# EAGLE design Wireless_Motor_Driver_Shield (EAGLE 7.6.0)
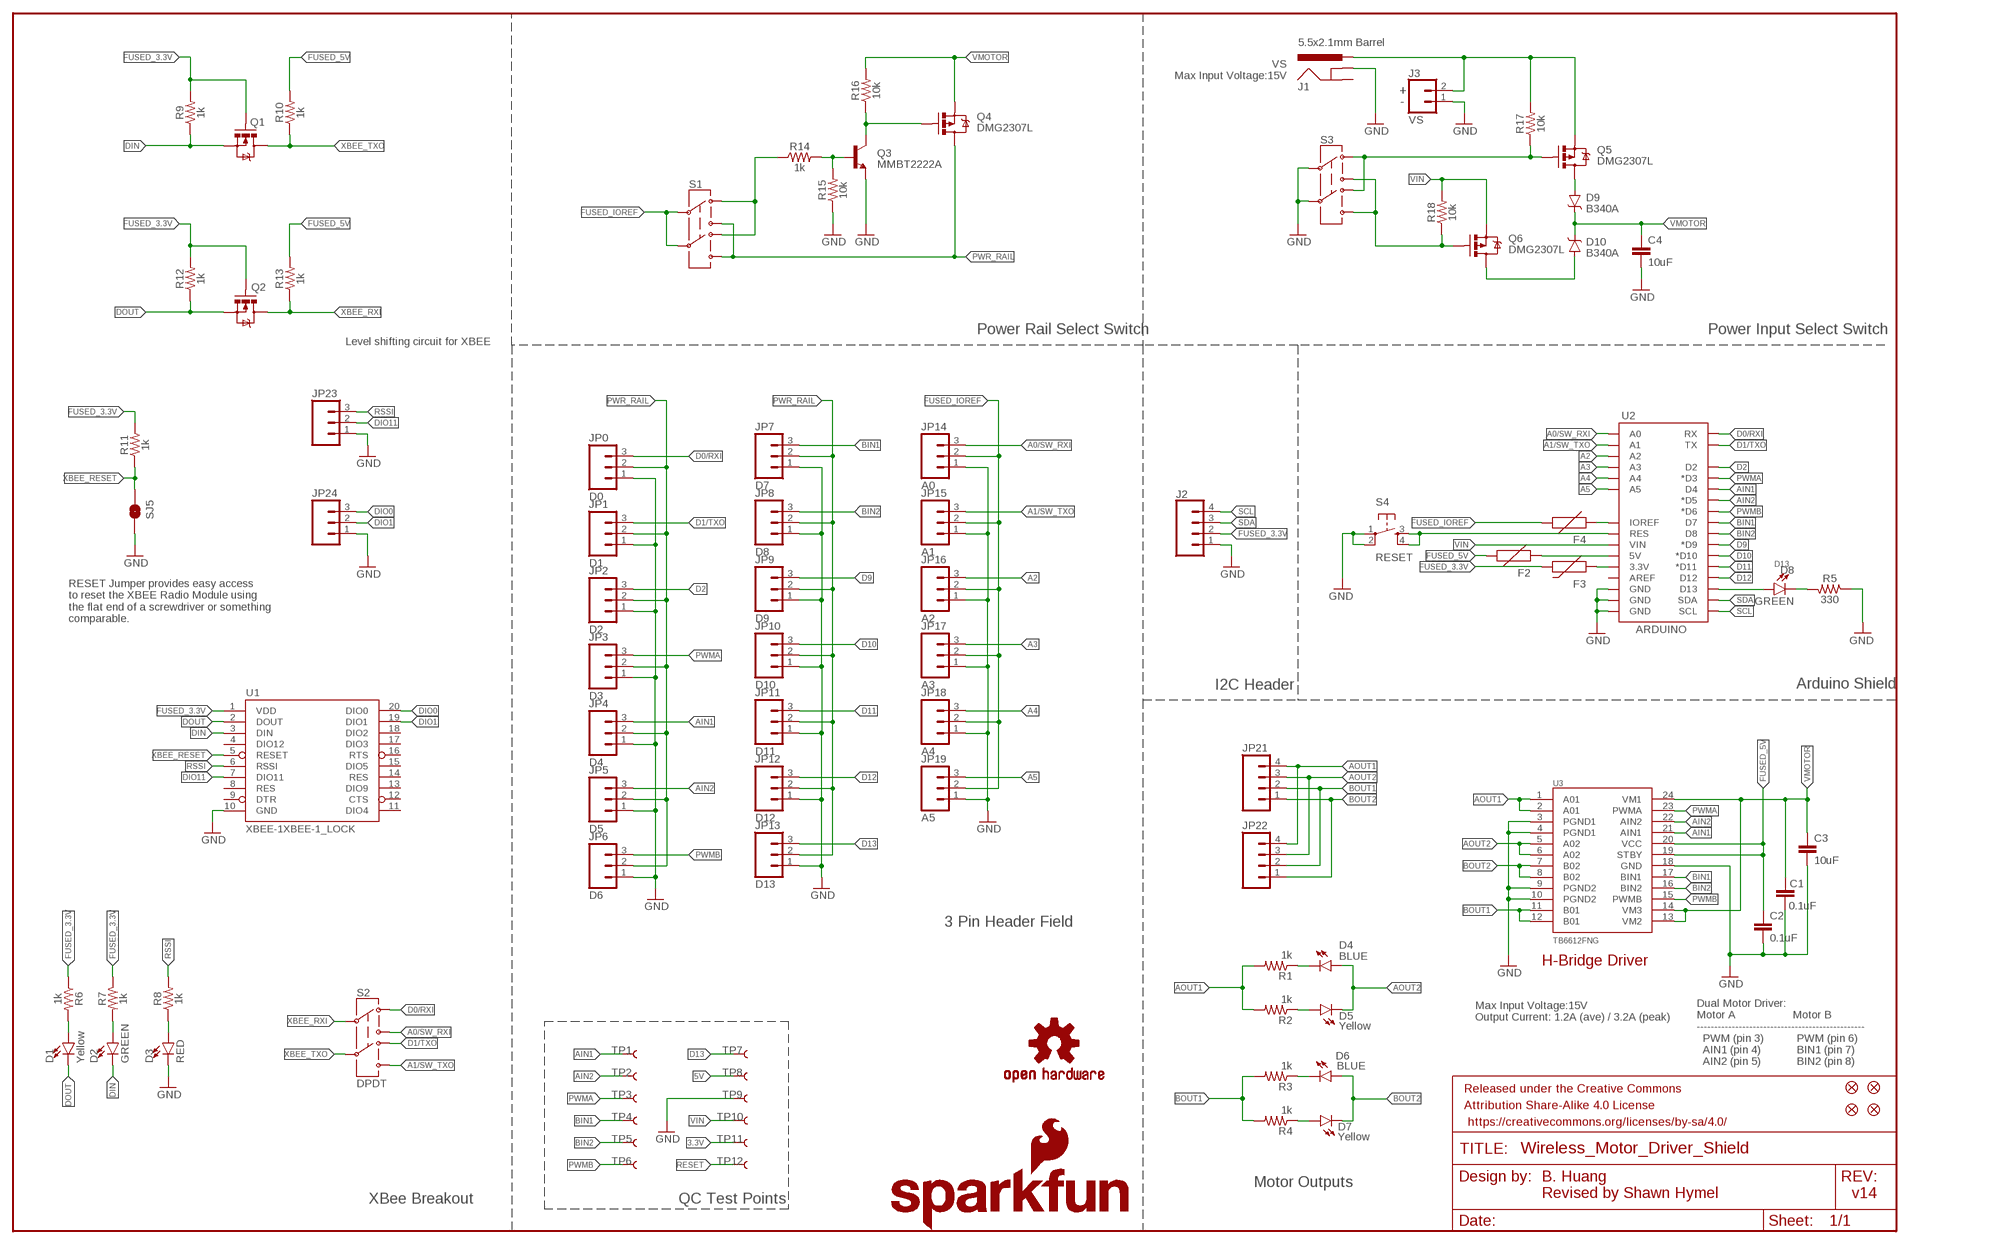
[diagram p0: schematic, sheet 1]

## Parts
C1  0.1uF  0.1UF-0603-25V-5%  [0603]
C2  0.1uF  0.1UF-0603-25V-5%  [0603]
C3  10uF  10UF-1210-50V-20%  [1210]
C4  10uF  10UF-1210-50V-20%  [1210]
D1  Yellow  LED-YELLOW0603  [LED-0603]
D2  GREEN  LED-GREEN0603  [LED-0603]
D3  RED  LED-RED0603  [LED-0603]
D4  BLUE  LED-BLUE0603  [LED-0603]
D5  Yellow  LED-YELLOW0603  [LED-0603]
D6  BLUE  LED-BLUE0603  [LED-0603]
D7  Yellow  LED-YELLOW0603  [LED-0603]
D8  GREEN  LED-GREEN0603  [LED-0603]
D9  B340A  DIODE-SCHOTTKY-B340A  [SMA-DIODE]
D10  B340A  DIODE-SCHOTTKY-B340A  [SMA-DIODE]
F2  PTCSMD  [PTC-1206]
F3  PTCSMD  [PTC-1206]
F4  PTCSMD  [PTC-1206]
FID1  FIDUCIAL1X2  [FIDUCIAL-1X2]
FID2  FIDUCIAL1X2  [FIDUCIAL-1X2]
FID3  FIDUCIAL1X2  [FIDUCIAL-1X2]
FID4  FIDUCIAL1X2  [FIDUCIAL-1X2]
FRAME1  FRAME-LEDGER  [CREATIVE_COMMONS]
J1  5.5x2.1mm Barrel  POWER_JACKSMD  [POWER_JACK_SMD]
J2  CONN_04SMD_RA_FEMALE  [1X04_SMD_RA_FEMALE]
J3  CONN_021X02_NO_SILK  [1X02_NO_SILK]
JP0  D0  M03LOCK  [1X03_LOCK]
JP1  D1  M03LOCK  [1X03_LOCK]
JP2  D2  M03LOCK  [1X03_LOCK]
JP3  D3  M03LOCK  [1X03_LOCK]
JP4  D4  M03LOCK  [1X03_LOCK]
JP5  D5  M03LOCK  [1X03_LOCK]
JP6  D6  M03LOCK  [1X03_LOCK]
JP7  D7  M03LOCK  [1X03_LOCK]
JP8  D8  M03LOCK  [1X03_LOCK]
JP9  D9  M03LOCK  [1X03_LOCK]
JP10  D10  M03LOCK  [1X03_LOCK]
JP11  D11  M03LOCK  [1X03_LOCK]
JP12  D12  M03LOCK  [1X03_LOCK]
JP13  D13  M03LOCK  [1X03_LOCK]
JP14  A0  M03LOCK  [1X03_LOCK]
JP15  A1  M03LOCK  [1X03_LOCK]
JP16  A2  M03LOCK  [1X03_LOCK]
JP17  A3  M03LOCK  [1X03_LOCK]
JP18  A4  M03LOCK  [1X03_LOCK]
JP19  A5  M03LOCK  [1X03_LOCK]
JP21  M04PTH  [1X04@1]
JP22  M04LOCK  [1X04_LOCK@1]
JP23  M031X03_NO_SILK  [1X03_NO_SILK]
JP24  M031X03_NO_SILK  [1X03_NO_SILK]
LOGO1  OSHW-LOGOM  [OSHW-LOGO-M]
LOGO2  SFE_LOGO_NAME_FLAME.1_INCH  [SFE_LOGO_NAME_FLAME_.1]
LOGO3  SFE_LOGO_FLAME.2_INCH  [SFE_LOGO_FLAME_.2]
LOGO4  SFE_LOGO_NAME_FLAME.1_INCH  [SFE_LOGO_NAME_FLAME_.1]
Q1  MOSFET-NCHANNELBSS138  [SOT23-3]
Q2  MOSFET-NCHANNELBSS138  [SOT23-3]
Q3  MMBT2222A  TRANSISTOR_NPNMMBT2222A  [SOT23-3]
Q4  DMG2307L  MOSFET-PCHANNELDMG2307L  [SOT23-3]
Q5  DMG2307L  MOSFET-PCHANNELDMG2307L  [SOT23-3]
Q6  DMG2307L  MOSFET-PCHANNELDMG2307L  [SOT23-3]
R1  1k  1KOHM-0603-1/10W-1%  [0603]
R2  1k  1KOHM-0603-1/10W-1%  [0603]
R3  1k  1KOHM-0603-1/10W-1%  [0603]
R4  1k  1KOHM-0603-1/10W-1%  [0603]
R5  330  330OHM-0603-1/10W-1%  [0603]
R6  1k  1KOHM-0603-1/10W-1%  [0603]
R7  1k  1KOHM-0603-1/10W-1%  [0603]
R8  1k  1KOHM-0603-1/10W-1%  [0603]
R9  1k  1KOHM-0603-1/10W-1%  [0603]
R10  1k  1KOHM-0603-1/10W-1%  [0603]
R11  1k  1KOHM-0603-1/10W-1%  [0603]
R12  1k  1KOHM-0603-1/10W-1%  [0603]
R13  1k  1KOHM-0603-1/10W-1%  [0603]
R14  1k  1KOHM-0603-1/10W-1%  [0603]
R15  10k  10KOHM-0603-1/10W-1%  [0603]
R16  10k  10KOHM-0603-1/10W-1%  [0603]
R17  10k  10KOHM-0603-1/10W-1%  [0603]
R18  10k  10KOHM-0603-1/10W-1%  [0603]
S1  SWITCH-DPDTAYZ0202  [AYZ0202]
S2  DPDT  SWITCH-DPDTAYZ0202  [AYZ0202]
S3  SWITCH-DPDTAYZ0202  [AYZ0202]
S4  RESET  TAC_SWITCHSMD  [TACTILE-SWITCH-SMD]
SJ5  SOLDERJUMPERNO  [SJ_2S-NO]
TP1  TEST-POINT3X5  [PAD.03X.05]
TP2  TEST-POINT3X5  [PAD.03X.05]
TP3  TEST-POINT3X5  [PAD.03X.05]
TP4  TEST-POINT3X5  [PAD.03X.05]
TP5  TEST-POINT3X5  [PAD.03X.05]
TP6  TEST-POINT3X5  [PAD.03X.05]
TP7  TEST-POINT3X5  [PAD.03X.05]
TP8  TEST-POINT3X5  [PAD.03X.05]
TP9  TEST-POINT3X5  [PAD.03X.05]
TP10  TEST-POINT3X5  [PAD.03X.05]
TP11  TEST-POINT3X5  [PAD.03X.05]
TP12  TEST-POINT3X5  [PAD.03X.05]
U1  XBEE-1XBEE-1_LOCK  [XBEE-1_LOCK]
U2  ARDUINO  ARDUINO_R3_SHIELDUNO_R3_SHIELD_NOLABELS_LOCK  [UNO_R3_SHIELD_NOLABELS_LOCK]
U3  TB6612FNG  [SSOP24]

## Nets
3.3V: F3.1 TP11.P$1 U2.3.3V
5V: F2.1 TP8.P$1 U2.5V
A0/SW_RXI: JP14.3 S2.3 U2.A0
A1/SW_TXO: JP15.3 S2.6 U2.A1
A2: JP16.3 U2.A2
A3: JP17.3 U2.A3
A4: JP18.3 U2.A4
A5: JP19.3 U2.A5
AIN1: JP4.3 TP1.P$1 U2.D4 U3.21(AIN1)
AIN2: JP5.3 TP2.P$1 U2.D5(*D5) U3.22(AIN2)
AOUT1: JP21.4 JP22.4 R1.2 R2.2 U3.1(A01) U3.2(A01)
AOUT2: D4.A D5.C JP21.3 JP22.3 U3.5(A02) U3.6(A02)
BIN1: JP7.3 TP4.P$1 U2.D7 U3.17(BIN1)
BIN2: JP8.3 TP5.P$1 U2.D8 U3.16(BIN2)
BOUT1: JP21.2 JP22.2 R3.2 R4.2 U3.11(B01) U3.12(B01)
BOUT2: D6.A D7.C JP21.1 JP22.1 U3.7(B02) U3.8(B02)
D0/RXI: JP0.3 S2.1 U2.RX
D1/TXO: JP1.3 S2.4 U2.TX
D2: JP2.3 U2.D2
D9: JP9.3 U2.D9(*D9)
D10: JP10.3 U2.D10(*D10)
D11: JP11.3 U2.D11(*D11)
D12: JP12.3 U2.D12
D13: D8.A JP13.3 TP7.P$1 U2.D13
DIN: D2.C Q1.2(S) R9.1 U1.3(DIN)
DIO0: JP24.3 U1.20(DIO0)
DIO1: JP24.2 U1.19(DIO1)
DIO11: JP23.2 U1.7(DIO11)
DOUT: D1.C Q2.2(S) R12.1 U1.2(DOUT)
FUSED_3.3V: F3.2 J2.2 Q1.1(G) Q2.1(G) R6.1 R7.1 R9.2 R11.2 R12.2 U1.1(VDD)
FUSED_5V: C2.1 F2.2 R10.2 R13.2 U3.19(STBY) U3.20(VCC)
FUSED_IOREF: F4.2 JP14.2 JP15.2 JP16.2 JP17.2 JP18.2 JP19.2 S1.2 S1.5
GND: C1.2 C2.2 C3.2 C4.2 D3.C J1.GND(GNDBREAK) J2.1 J3.1 JP0.1 JP1.1 JP2.1 JP3.1 JP4.1 JP5.1 JP6.1 JP7.1 JP8.1 JP9.1 JP10.1 JP11.1 JP12.1 JP13.1 JP14.1 JP15.1 JP16.1 JP17.1 JP18.1 JP19.1 JP23.1 JP24.1 Q3.2(E) R5.1 R15.1 S3.2 S3.5 S4.1 S4.2 SJ5.2 TP9.P$1 U1.10(GND) U2.GND@0(GND) U2.GND@1(GND) U2.GND@2(GND) U3.3(PGND1) U3.4(PGND1) U3.9(PGND2) U3.10(PGND2) U3.18(GND)
IOREF: F4.1 U2.IOREF
N$1: D8.C R5.2
N$2: Q3.1(B) R14.2 R15.2
N$3: D5.A R2.1
N$4: Q6.1(G) R18.1 S3.3 S3.6
N$5: D4.C R1.1
N$8: D7.A R4.1
N$9: D6.C R3.1
N$10: J1.VIN0(PWR) J3.2 Q5.2(S) R17.2
N$11: Q3.3(C) Q4.1(G) R16.1
N$12: Q5.1(G) R17.1 S3.1 S3.4
N$13: R14.1 S1.1 S1.4
N$15: D9.A Q5.3(D)
N$16: D10.A Q6.3(D)
N$22: D1.A R6.2
N$43: D2.A R7.2
N$44: D3.A R8.1
PWMA: JP3.3 TP3.P$1 U2.D3(*D3) U3.23(PWMA)
PWMB: JP6.3 TP6.P$1 U2.D6(*D6) U3.15(PWMB)
PWR_RAIL: JP0.2 JP1.2 JP2.2 JP3.2 JP4.2 JP5.2 JP6.2 JP7.2 JP8.2 JP9.2 JP10.2 JP11.2 JP12.2 JP13.2 Q4.3(D) S1.3 S1.6
RESET: S4.3 S4.4 TP12.P$1 U2.RES
RSSI: JP23.3 R8.2 U1.6(RSSI)
SCL: J2.4 U2.SCL
SDA: J2.3 U2.SDA
VIN: Q6.2(S) R18.2 TP10.P$1 U2.VIN
VMOTOR: C1.1 C3.1 C4.1 D9.C D10.C Q4.2(S) R16.2 U3.13(VM2) U3.14(VM3) U3.24(VM1)
XBEE_RESET: R11.1 SJ5.1 U1.5(RESET)
XBEE_RXI: Q2.3(D) R13.1 S2.2
XBEE_TXO: Q1.3(D) R10.1 S2.5
Unconnected: J1.P$4(GND) U1.4(DIO12) U1.8(RES) U1.9(DTR) U1.11(DIO4) U1.12(CTS) U1.13(DIO9) U1.14(RES) U1.15(DIO5) U1.16(RTS) U1.17(DIO3) U1.18(DIO2) U2.AREF

## Notes on the sheet
- VS
  Max Input Voltage:15V
- +
- -
- VS
- Power Rail Select Switch | Power Input Select Switch
- Level shifting circuit for XBEE
- RESET Jumper provides easy access 
  to reset the XBEE Radio Module using 
  the flat end of a screwdriver or something
  comparable.
- I2C Header | Arduino Shield
- 3 Pin Header Field
- H-Bridge Driver
- Max Input Voltage:15V
  Output Current: 1.2A (ave) / 3.2A (peak)
- Dual Motor Driver:
  Motor A                   Motor B
  ------------------------------------------------
    PWM (pin 3)           PWM (pin 6) 
    AIN1 (pin 4)            BIN1 (pin 7)
    AIN2 (pin 5)            BIN2 (pin 8)
- Motor Outputs
- B. Huang
  Revised by Shawn Hymel
- v14
- XBee Breakout | QC Test Points

## Library data of the parts
C1 C2 = SparkFun-Capacitors:0.1UF: 0.1µF ceramic capacitors A capacitor is a passive two-terminal electrical component used to store electrical energy temporarily in an electric field.; PROD_ID: CAP-08604
C3 C4 = SparkFun-Capacitors:10UF: 10.0µF ceramic capacitors A capacitor is a passive two-terminal electrical component used to store electrical energy temporarily in an electric field.; PROD_ID: CAP-09824
D1 D5 D7 = SparkFun-LED:LED-YELLOW: Yellow SMD LED Used in manufacturing several products at SparkFun. Packages: 0603 - SMD 0603 package[Product Link] <http://www.kingbrightusa.com/product.asp?catalog_name=LED&product_id=APT1608SYCK> 0603 -SMART - SMART SMD 0603 package (more efficient/more expensive) [Product Link] <http://www.osram-os.com/osram_os/en/products/product-catalog/led-light-emitting-diodes/smartled-0603/ly-l29k/index.jsp> LilyPad - SMD1206 package[Product Datasheet] <https://www.sparkfun.com/datasheets/DevTools/LilyPad/Q150YUS4.pdf> SparkFun Products: Blynk Board <https://www.sparkfun.com/products/13794> IOIO-OTG <https://www.sparkfun.com/products/13613> XBee Explorer Serial <https://www.sparkfun.com/products/13225>; PROD_ID: DIO-09003
D2 D8 = SparkFun-LED:LED-GREEN: Green SMD LED Used in manufacturing of various products at SparkFun Packages: 0603 - SMD 0603 package [Product Link] <http://www.futureelectronics.com/en/technologies/semiconductors/optoelectronics/leds/Pages/9894312-LTST-C190GKT.aspx?CrossPart=HSMG-C190&IM=0> LilyPad 1206 - SMD1206 LilyPad package [Product Link] <http://www.futureelectronics.com/en/Technologies/Product.aspx?ProductID=IN150NGHARVATEKCORPORATION2049943&IM=0> 1206 - SMD1206 package [Product Link] <http://www.futureelectronics.com/en/technologies/semiconductors/optoelectronics/leds/Pages/8315665-LTST-C150KGKT.aspx?IM=0> 1206 Bottom Mount -SMD 1206 Bottom Mount [Product Link] <http://www.digikey.com/product-detail/en/lite-on-inc/LTST-C230KGKT/160-1456-1-ND/386854> SparkFun Products: Pro Mini 328 -5V <https://www.sparkfun.com/products/821> RedBoard <https://www.sparkfun.com/products/12757> MP3 Trigger <https://www.sparkfun.com/products/13720> Makey Makey <https://www.sparkfun.com/products/11076>; PROD_ID: DIO-00821
D3 = SparkFun-LED:LED-RED: Red SMD LED Used in manufacturing of most products at SparkFun Packages: 0603 - SMD 0603 package [Product Link] <http://docs.avagotech.com/docs/AV02-0551EN> 0603 SMART - SMD 0603 SMART package ( more efficient and expensive)[Product Link] <http://www.osram-os.com/Graphics/XPic2/00077099_0.pdf> 1206 - SMD1206 package [Product Link] <https://www.sparkfun.com/datasheets/DevTools/LilyPad/Q150OVS4.pdff> SparkFun Products: Pro Mini 328 -5V <https://www.sparkfun.com/products/821> RedBoard <https://www.sparkfun.com/products/12757> IOIO-OTG <https://www.sparkfun.com/products/13613>; PROD_ID: DIO-00819
D4 D6 = SparkFun-LED:LED-BLUE: Blue SMD LED Used in manufacturing of various products at SparkFun Packages: 0603 - SMD 0603 package [Product Link] <http://www.digikey.com/product-detail/en/SMLE12BC7TT86/511-1589-2-ND/1641808> 1206 - SMD1206 package [Product Link] <http://www.digikey.com/product-detail/en/lite-on-inc/LTST-C150TBKT/160-1643-1-ND/573584> SparkFun Products: ESP8266 Thing-Dev Board <https://www.sparkfun.com/products/13711> RedBoard <https://www.sparkfun.com/products/12757>; PROD_ID: DIO-08575
D9 D10 = SparkFun-DiscreteSemi:DIODE-SCHOTTKY: Schottky diodes in SFE's production catalog BAT20J 1A 23V 0.62Vf RB751 120mA 40V 0.37Vf PMEG4005EJ 0.5A 40V 0.42Vf MBRA140 1A 40V 0.5Vf B340A 3A 40V SMA; PROD_ID: DIO-09886
F2-F4 = SparkFun-PowerIC:PTC: Resettable Fuse PTC Resettable Fuse. Spark Fun Electronics SKU : COM-08357; PROD_ID: RES-11150
FID1-FID4 = SparkFun-Aesthetics:FIDUCIAL: Fiducial Alignment Points Various fiducial points for machine vision alignment.
FRAME1 = SparkFun-Aesthetics:FRAME-LEDGER: Schematic Frame Standard 11x14 US Ledger frame
J1 = SparkFun-Connectors:POWER_JACK: Power Jack Connector This is the standard 5.5mm barrel jack for power. The PTH is the most common, proven, reliable, footprint. The Slot footprint only works if the mill layer is transmitted to the PCB fab house so be warned. Here are the connectors we sell at SparkFun: DC Barrel Power Jack/Connector <https://www.sparkfun.com/products/119> (PRT-00119) DC Barrel Power Jack/Connector (SMD) <https://www.sparkfun.com/products/12748> (PRT-12748) DC Barrel Jack Adapter - Breadboard Compatible <https://www.sparkfun.com/products/10811> (PRT-10811) It is used on this SparkFun product (and many, many others): SparkFun RedBoard - Programmed with Arduino <https://www.sparkfun.com/products/12757> (DEV-12757) Also, if you need a mating power supply or connector, please check these out: Wall Adapter Power Supply - 9VDC 650mA <https://www.sparkfun.com/products/298> (TOL-00298) DC Barrel Jack Adapter - Male <https://www.sparkfun.com/products/10287> (PRT-10287); PROD_ID: CONN-08106; SF_ID: PRT-12748
J2 = SparkFun-Connectors:CONN_04: Multi connection point. Often used as Generic Header-pin footprint for 0.1 inch spaced/style header connections On any of the 0.1 inch spaced packages, you can populate with these: Break Away Headers - Straight <https://www.sparkfun.com/products/116> (PRT-00116) Break Away Male Headers - Right Angle <https://www.sparkfun.com/products/553> (PRT-00553) Female Headers <https://www.sparkfun.com/products/115> (PRT-00115) Break Away Headers - Machine Pin <https://www.sparkfun.com/products/117> (PRT-00117) Break Away Female Headers - Swiss Machine Pin <https://www.sparkfun.com/products/743> (PRT-00743) For SCREWTERMINALS and SPRING TERMINALS visit here: Screw Terimnals on SparkFun.com <https://www.sparkfun.com/search/results?term=Screw+Terminals> (5mm/3.5mm/2.54mm spacing) This device is also useful as a general connection point to wire up your design to another part of your project. Our various solder wires solder well into these plated through hole pads. Hook-Up Wire - Assortment (Stranded, 22 AWG) <https://www.sparkfun.com/products/11375> (PRT-11375) Hook-Up Wire - Assortment (Solid Core, 22 AWG) <https://www.sparkfun.com/products/11367> (PRT-11367) View the entire wire category on our website here <https://www.sparkfun.com/categories/141> Special notes: Molex polarized connector foot print use with SKU : PRT-08231 with associated crimp pins and housings. 1MM SMD Version SKU: PRT-10208; PROD_ID: CONN-12382
J3 = SparkFun-Connectors:CONN_02: Multi connection point. Often used as Generic Header-pin footprint for 0.1 inch spaced/style header connections On any of the 0.1 inch spaced packages, you can populate with these: Break Away Headers - Straight <https://www.sparkfun.com/products/116> (PRT-00116) Break Away Male Headers - Right Angle <https://www.sparkfun.com/products/553> (PRT-00553) Female Headers <https://www.sparkfun.com/products/115> (PRT-00115) Break Away Headers - Machine Pin <https://www.sparkfun.com/products/117> (PRT-00117) Break Away Female Headers - Swiss Machine Pin <https://www.sparkfun.com/products/743> (PRT-00743) For SCREWTERMINALS and SPRING TERMINALS visit here: Screw Terimnals on SparkFun.com <https://www.sparkfun.com/search/results?term=Screw+Terminals> (5mm/3.5mm/2.54mm spacing) This device is also useful as a general connection point to wire up your design to another part of your project. Our various solder wires solder well into these plated through hole pads. Hook-Up Wire - Assortment (Stranded, 22 AWG) <https://www.sparkfun.com/products/11375> (PRT-11375) Hook-Up Wire - Assortment (Solid Core, 22 AWG) <https://www.sparkfun.com/products/11367> (PRT-11367) View the entire wire category on our website here <https://www.sparkfun.com/categories/141> Special notes: Molex polarized connector foot print use with: PRT-08233 with associated crimp pins and housings. 2.54_SCREWTERM for use with PRT-10571. 3.5mm Screw Terminal footprints for PRT-08084 5mm Screw Terminal footprints for use with PRT-08432
JP0 JP1-JP19 JP23 JP24 = SparkFun-Connectors:M03: Header 3 Standard 3-pin 0.1" header. Use with straight break away headers (SKU : PRT-00116), right angle break away headers (PRT-00553), swiss pins (PRT-00743), machine pins (PRT-00117), and female headers (PRT-00115). Molex polarized connector foot print use with SKU : PRT-08232 with associated crimp pins and housings.
JP21 JP22 = SparkFun-Connectors:M04: Header 4 Standard 4-pin 0.1" header. Use with straight break away headers (SKU : PRT-00116), right angle break away headers (PRT-00553), swiss pins (PRT-00743), machine pins (PRT-00117), and female headers (PRT-00115). Molex polarized connector foot print use with SKU : PRT-08231 with associated crimp pins and housings. 1MM SMD Version SKU: PRT-10208; PROD_ID: CONN-09696
LOGO1 = SparkFun-Aesthetics:OSHW-LOGO: Open Source Hardware Logo This logo indicates the piece of hardware it is found on incorporates a OSHW license and/or adheres to the definition of open source hardware found here: http://freedomdefined.org/OSHW
LOGO2 LOGO4 = SparkFun-Aesthetics:SFE_LOGO_NAME_FLAME: SFE Logo, name and flame This is the SparkFun full logo. The logo on the schematic will always be the same size; the package variant is the height of the flame part of the logo. Default layer for the logo on the board is tSilk.
LOGO3 = SparkFun-Aesthetics:SFE_LOGO_FLAME: SFE Logo, flame only This is the SparkFun flame logo. The logo on the schematic will always be the same size; the package variant is the height of the flame. Default layer for the logo on the board is tSilk.
Q1 Q2 = SparkFun-DiscreteSemi:MOSFET-NCHANNEL: Common NMOSFET Parts MFG P/N Store ID Prod ID FDD8780 TRANS-09984 SI7820DN TRANS-11055 FDS6630A IC-08089 2N7002PW TRANS-11151 FQP30N06L COM-10213 TRANS-10060 BSS123LT1G TRANS-08345 BSS138 TRANS-00830 BS170 2N7000; PROD_ID: TRANS-00830; VALUE: 200mA/50V
Q3 = SparkFun-DiscreteSemi:TRANSISTOR_NPN: Generic NPN BJT MMBT2222A - TRANS-08049 (SOT-23, 1A 40V) MPSA42 - TRANS-09116 (SOT-23, 500mA 300V) MMBT5088LT1G - TRANS-11160 (SOT-23, 50 mA 30V) BC547 - COM-08928 <http://www.sparkfun.com/products/8928> (TO-92 45V 100mA) (1.Collector 2.Base 3.Emitter) 2N3904 - COM-00521 <http://www.sparkfun.com/products/521> (TO-92 40V 200mA) (1.Emitter 2.Base 3.Collector) P2N2222A - COM-12852 <http://www.sparkfun.com/products/12852> (TO-92 40V 600mA) (1.Collector 2.Base 3.Emitter); PROD_ID: TRANS-08049
Q4-Q6 = SparkFun-DiscreteSemi:MOSFET-PCHANNEL: Generic PMOSFET IRLML2244 - TRANS-11153 (SOT-23 -20V -4.3A) (1.Gate 2.Source 3.Drain) FQP27P06 - COM-10349 <http://www.sparkfun.com/products/10349> (TO-220 -60V -27A) (1.Gate 2.Source 3.Drain); PROD_ID: TRANS-11308; VALUE: 2.5A/30V
R1-R4 R6-R14 = SparkFun-Resistors:1KOHM: 1kΩ resistor A resistor is a passive two-terminal electrical component that implements electrical resistance as a circuit element. Resistors act to reduce current flow, and, at the same time, act to lower voltage levels within circuits. - Wikipedia; PROD_ID: RES-07856
R5 = SparkFun-Resistors:330OHM: 330Ω resistor A resistor is a passive two-terminal electrical component that implements electrical resistance as a circuit element. Resistors act to reduce current flow, and, at the same time, act to lower voltage levels within circuits. - Wikipedia; PROD_ID: RES-00818
R15-R18 = SparkFun-Resistors:10KOHM: 10kΩ resistor A resistor is a passive two-terminal electrical component that implements electrical resistance as a circuit element. Resistors act to reduce current flow, and, at the same time, act to lower voltage levels within circuits. - Wikipedia; PROD_ID: RES-00824
S1 S3 = SparkFun-Electromechanical:SWITCH-DPDT: DPDT Version of the COM-00597; PROD_ID: SWCH-08179; VALUE: DPDT
S2 = SparkFun-Electromechanical:SWITCH-DPDT: DPDT Version of the COM-00597; PROD_ID: SWCH-08179
S4 = SparkFun-Electromechanical:TAC_SWITCH: Momentary Switch Button commonly used for reset or general input. Spark Fun Electronics SKU : COM-00097 SMT- SWCH-08247; PROD_ID: SWCH-08247; VALUE: TAC_SWITCHSMD
SJ5 = SparkFun-Retired:SOLDERJUMPER: Solder Jumper Standard SMD solder jumper. Used to automate production. Two varients : Normally Open and Normally Closed are the same, but have different paste layers. NC will have a large amount of paste and should jumper during reflow.
TP1-TP12 = SparkFun-Passives:TEST-POINT: Bare copper test points for troubleshooting or ICT
U1 = SparkFun-RF:XBEE-1: Xbee module footprints
U2 = SparkFun-Boards:ARDUINO_R3_SHIELD: Shield form compatible with the Arduino Uno R3.
U3 = SparkFun-PowerIC:TB6612FNG: Toshiba 1A dual motor driver IC-09363; PROD_ID: IC-09363

## Net classes
1 vcc: width 0.305 mm

## Board
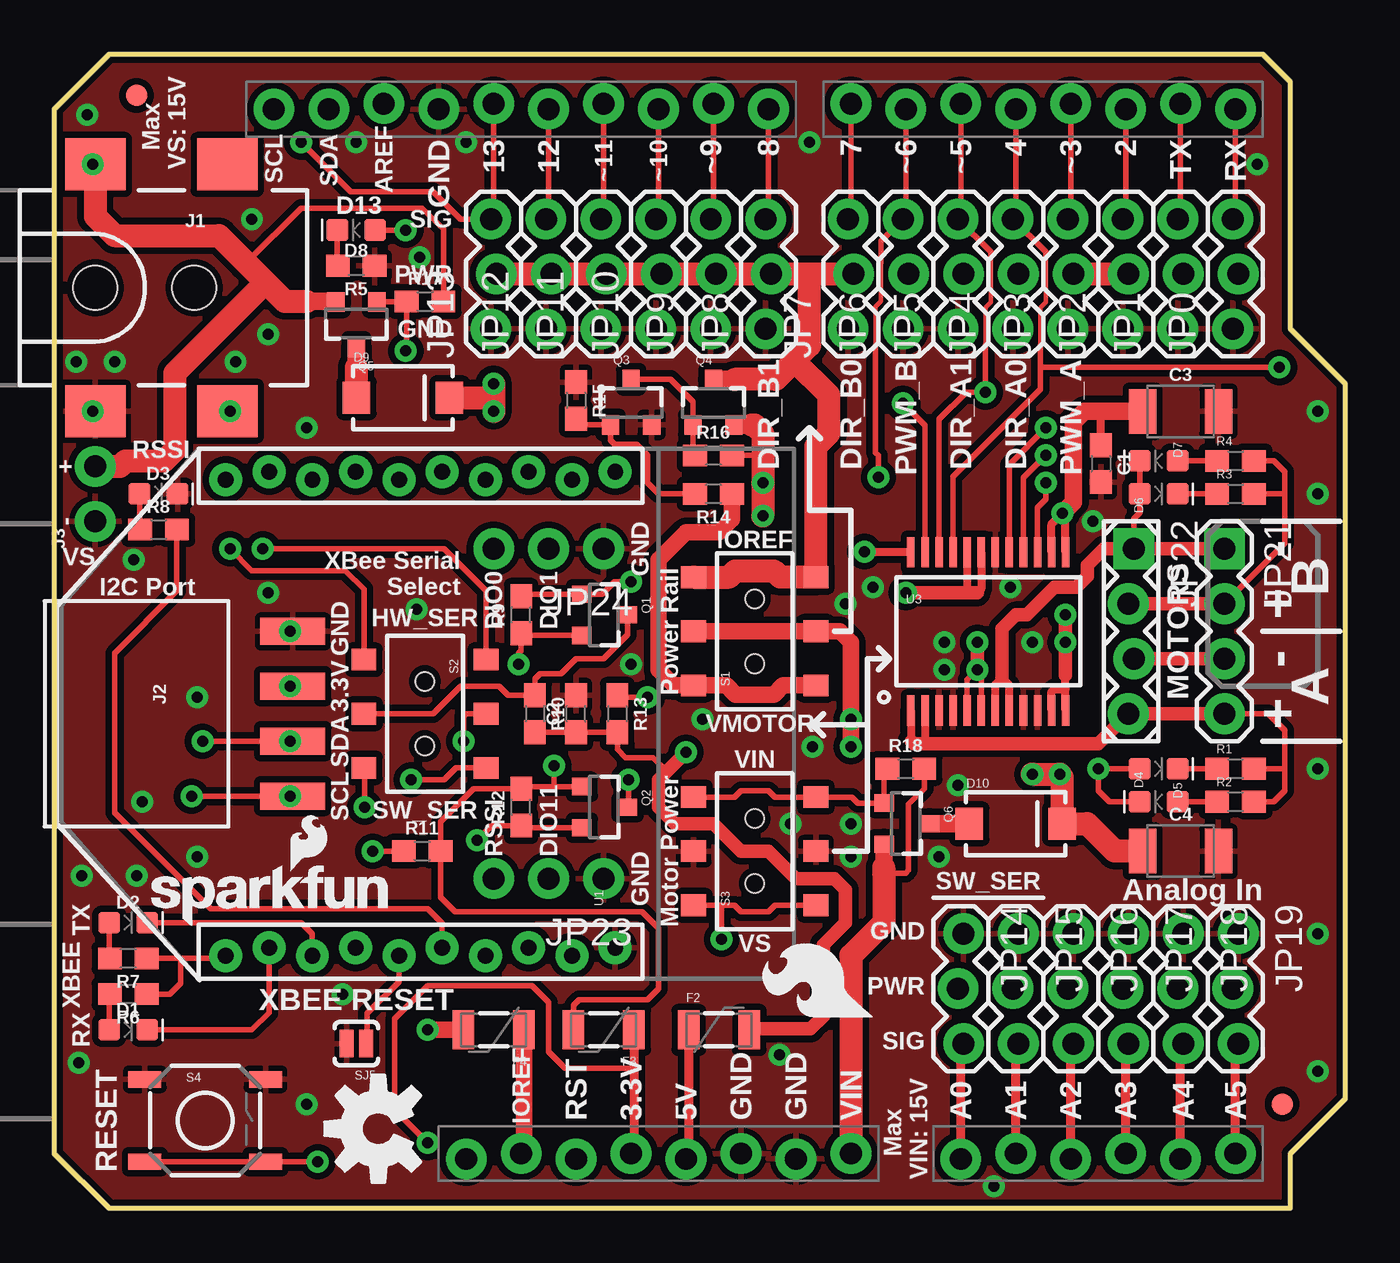
[diagram p1: board, top side]
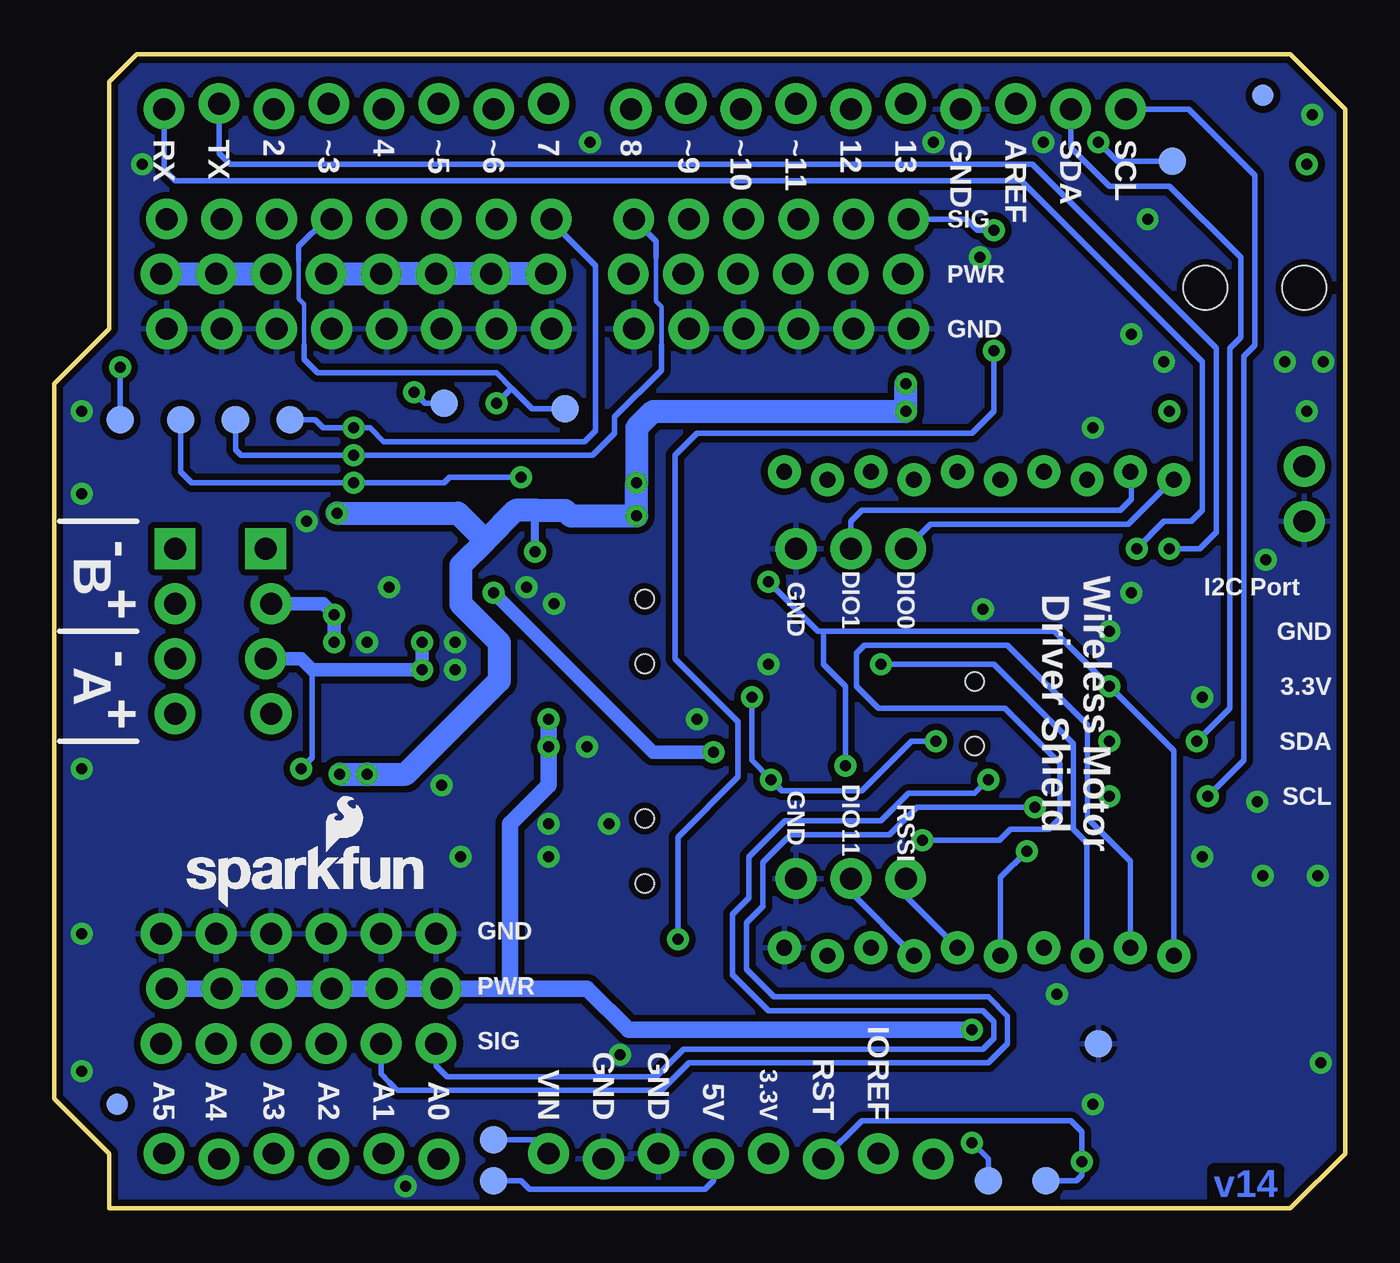
[diagram p2: board, bottom side, seen from below]

Size 59.69 x 53.34 mm. Coordinates in mm from the lower left corner, seen from the top.
Outline: 0,50.8 0,2.54 2.54,0 57.15,0 57.15,2.54 59.69,5.08 59.69,38.1 57.15,40.64 57.15,52.07 55.88,53.34 2.54,53.34 0,50.8
Copper layers (1*16): Top 0.035mm / dielectric 1.5mm / Bottom 0.035mm
Design rules "SparkFun-2-layer-STANDARD": minimum track width 10mil, minimum drill 20mil, track to track 10mil, track to pad 8mil, pad to pad 8mil, via to via 10mil, smd to smd 8mil, copper to edge 8mil, drill to drill 8mil, minimum pad ring 10mil, minimum via ring 10mil, stop-mask expansion 4mil, vias tented up to drill 25mil, thermal gap 10mil
tRestrict: area 41.1,22.9 to 41.4,23.1; area 45,22.9 to 45.2,23.1

### Footprints (pad centres in the part's own frame; a part is rotated, then mirrored left to right if it is on the bottom)
0603 = smd 1.1 x 1: 1 -0.85,0; 2 0.85,0
1210 = smd 1.27 x 2.06: 1 -1.755,0; 2 1.755,0
LED-0603 = smd 1 x 1: A -0.877,0; C 0.877,0
SMA-DIODE = smd 1.27 x 1.47: A -2.15,0; C 2.15,0
PTC-1206 = smd 1 x 1.8: 1 -1.4,0; 2 1.4,0
FIDUCIAL-1X2 = smd 1 x 1: 1 0,0
POWER_JACK_SMD = smd 2.8 x 2.4: GND 0,-5.7; P$4 6.1,-5.7; VIN0 0,5.7; VIN1 6.1,5.7 | hole 2.032: 0,0; 4.572,0
1X04_SMD_RA_FEMALE = smd 1.25 x 3: 1 -3.81,7.225; 2 -1.27,7.225; 3 1.27,7.225; 4 3.81,7.225
1X02_NO_SILK = drill 1.016 pad 1.88: 1 0,0; 2 2.54,0
1X03_LOCK = drill 1.016 pad 1.88: 1 0,0.127; 2 2.54,-0.127; 3 5.08,0.127
1X04@1 = drill 1.016 pad 1.88 square: 1 0,0 | drill 1.016 pad 1.88: 2 2.54,0; 3 5.08,0; 4 7.62,0
1X04_LOCK@1 = drill 1.016 pad 1.88 square: 1 0,0.127 | drill 1.016 pad 1.88: 2 2.54,-0.127; 3 5.08,0.127; 4 7.62,-0.127
1X03_NO_SILK = drill 1.016 pad 1.88: 1 0,0; 2 2.54,0; 3 5.08,0
SOT23-3 = smd 0.8 x 0.9: 1 -0.95,-1; 2 0.95,-1; 3 0,1.1
AYZ0202 = smd 1 x 1.15: 1 -2.5,2.825; 2 0,2.825; 3 2.5,2.825; 4 -2.5,-2.825; 5 0,-2.825; 6 2.5,-2.825 | hole 0.85: 1.5,0; -1.5,0
TACTILE-SWITCH-SMD = smd 1.524 x 0.762: 1 -2.794,1.905; 2 2.794,1.905; 3 -2.794,-1.905; 4 2.794,-1.905
SJ_2S-NO = smd 0.635 x 1.27: 1 -0.45,0; 2 0.45,0
PAD.03X.05 = smd 1.27 x 1.27: P$1 0,0
XBEE-1_LOCK = drill 0.737 pad 1.524: 1 -11.178,20; 2 -10.822,18; 3 -11.178,16; 4 -10.822,14; 5 -11.178,12; 6 -10.822,10; 7 -11.178,8; 8 -10.822,6; 9 -11.178,4; 10 -10.822,2; 11 11.178,2; 12 10.822,4; 13 11.178,6; 14 10.822,8; 15 11.178,10; 16 10.822,12; 17 11.178,14; 18 10.822,16; 19 11.178,18; 20 10.822,20
UNO_R3_SHIELD_NOLABELS_LOCK = drill 1.016 pad 1.88: 3.3V 50.8,26.67; 5V 51.054,29.21; A0 51.054,41.91; A1 50.8,44.45; A2 51.054,46.99; A3 50.8,49.53; A4 51.054,52.07; A5 50.8,54.61; AREF 2.286,15.24; D2 2.54,49.53; D3 2.286,46.99; D4 2.54,44.45; D5 2.286,41.91; D6 2.54,39.37; D7 2.286,36.83; D8 2.54,33.02; D9 2.286,30.48; D10 2.54,27.94; D11 2.286,25.4; D12 2.54,22.86; D13 2.286,20.32; GND@0 50.8,31.75; GND@1 51.054,34.29; GND@2 2.54,17.78; IOREF 50.8,21.59; NC 51.054,19.05; RES 51.054,24.13; RX 2.54,54.61; SCL 2.54,10.16; SDA 2.54,12.7; TX 2.286,52.07; VIN 50.8,36.83
SSOP24 = smd 0.348 x 1.397: 1 -3.575,-3.656; 2 -2.925,-3.656; 3 -2.275,-3.656; 4 -1.625,-3.656; 5 -0.975,-3.656; 6 -0.325,-3.656; 7 0.325,-3.656; 8 0.975,-3.656; 9 1.625,-3.656; 10 2.275,-3.656; 11 2.925,-3.656; 12 3.575,-3.656; 13 3.575,3.656; 14 2.925,3.656; 15 2.275,3.656; 16 1.625,3.656; 17 0.975,3.656; 18 0.325,3.656; 19 -0.325,3.656; 20 -0.975,3.656; 21 -1.625,3.656; 22 -2.275,3.656; 23 -2.925,3.656; 24 -3.575,3.656

### Placement (x,y rotation side)
C1  48.39,34.42 270 top
C2  24.13,22.86 90 top
C3  52.07,36.83 0 top
C4  52.07,16.51 0 top
D1  3.43,8.26 0 top
D2  3.43,13.21 0 top
D3  4.83,33.02 0 top
D4  51.05,20.32 0 top
D5  51.05,18.8 180 top
D6  51.05,33.02 0 top
D7  51.05,34.54 180 top
D8  13.97,45.21 180 top
D9  16.13,37.47 0 top
D10  44.45,17.78 0 top
F2  30.73,8.26 0 top
F3  25.4,8.26 180 top
F4  20.32,8.26 180 top
FID1  3.81,51.44 0 top
FID2  56.77,4.83 0 top
FID3  3.81,51.44 0 bottom
FID4  56.77,4.83 0 bottom
FRAME1  -3.81,-10.16 0 top  (outside the outline)
J1  1.91,42.55 0 top
J2  3.81,22.86 270 top
J3  1.91,31.75 90 top
JP0  54.61,40.64 90 top
JP1  52.07,40.64 90 top
JP2  49.53,40.64 90 top
JP3  46.99,40.64 90 top
JP4  44.45,40.64 90 top
JP5  41.91,40.64 90 top
JP6  39.37,40.64 90 top
JP7  36.83,40.64 90 top
JP8  33.02,40.64 90 top
JP9  30.48,40.64 90 top
JP10  27.94,40.64 90 top
JP11  25.4,40.64 90 top
JP12  22.86,40.64 90 top
JP13  20.32,40.64 90 top
JP14  41.91,12.7 270 top
JP15  44.45,12.7 270 top
JP16  46.99,12.7 270 top
JP17  49.53,12.7 270 top
JP18  52.07,12.7 270 top
JP19  54.61,12.7 270 top
JP21  54.1,30.48 270 top
JP22  49.78,30.48 270 top
JP23  25.4,15.24 180 top
JP24  25.4,30.48 180 top
LOGO1  14.99,3.68 90 top
LOGO2  4.06,12.95 0 top
LOGO3  38.1,8.51 90 top
LOGO4  53.98,13.84 0 bottom
Q1  25.4,27.43 270 top
Q2  25.4,18.54 270 top
Q3  26.67,37.21 0 top
Q4  30.48,37.21 0 top
Q5  13.97,40.89 180 top
Q6  39.37,17.78 270 top
R1  54.61,20.32 0 top
R2  54.61,18.8 0 top
R3  54.61,33.02 0 top
R4  54.61,34.54 0 top
R5  13.97,43.56 180 top
R6  3.43,9.91 180 top
R7  3.43,11.56 180 top
R8  4.83,31.37 0 top
R9  21.59,27.43 90 top
R10  22.23,22.86 270 top
R11  17.02,16.51 0 top
R12  21.59,18.54 90 top
R13  26.04,22.86 270 top
R14  30.48,33.02 180 top
R15  24.13,37.34 270 top
R16  30.48,34.8 0 top
R17  17.14,41.91 0 top
R18  39.37,20.32 0 top
S1  32.38,26.67 90 top
S2  17.14,22.86 270 top
S3  32.38,16.51 90 top
S4  6.99,4.06 0 top
SJ5  13.97,7.62 180 top
TP1  56.64,36.45 90 bottom
TP2  41.66,37.21 90 bottom
TP3  36.07,36.96 90 bottom
TP4  48.77,36.45 90 bottom
TP5  51.31,36.45 90 bottom
TP6  53.85,36.45 180 bottom
TP7  8,48.39 180 bottom
TP8  39.37,1.27 90 bottom
TP9  11.43,7.62 0 bottom
TP10  39.37,3.17 0 bottom
TP11  16.51,1.27 0 bottom
TP12  13.84,1.27 0 bottom
U1  27.94,22.86 90 top
U2  0,53.34 270 top
U3  43.18,26.67 0 top

### Tracks (layer width: path | path; a pad name or v marks a point on that pad's centre or on a via)
3.3V  (via drill 0.51)
  Top 0.254: v17.27,3.05 15.75,4.57 15.75,8.76 17.27,10.29 22.1,10.29 22.86,9.53 22.86,7.24 23.62,6.48 26.8,6.48
  Top 0.406: F3.1 26.8,6.48 26.8,2.67 U2.3.3V
  Bottom 0.254: TP11.P$1 16.51,2.29 v17.27,3.05
5V
  Top 0.406: F2.1 29.33,2.41 U2.5V
  Bottom 0.254: U2.5V 29.21,1.27 29.59,0.89 37.72,0.89 38.1,1.27 TP8.P$1
A0/SW_RXI  (via drill 0.51)
  Top 0.254: S2.3 18.58,20.36 18.03,19.81 v16.51,19.81
  Top 0.406: U2.A0 41.91,7.49 JP14.3
  Bottom 0.254: JP14.3 42.04,6.6 41.53,6.1 31.88,6.1 30.61,7.37 16.76,7.37 16.26,7.87 16.26,8.64 16.76,9.14 26.67,9.14 28.32,10.79 28.32,13.59 27.56,14.35 27.56,16.26 25.91,17.91 21.46,17.91 20.19,19.18 17.14,19.18 v16.51,19.81
A1/SW_TXO  (via drill 0.51)
  Top 0.254: v14.35,18.54 14.35,20.33 S2.6
  Top 0.406: U2.A1 44.45,7.49 JP15.3
  Bottom 0.254: JP15.3 44.58,6.22 44.2,5.84 43.94,5.59 43.81,5.46 31.62,5.46 30.35,6.73 16.51,6.73 15.62,7.62 15.62,8.89 16.51,9.78 26.42,9.78 27.69,11.05 27.69,13.21 26.92,13.97 26.92,16 25.65,17.27 21.08,17.27 19.81,18.54 v14.35,18.54
A2
  Top 0.406: U2.A2 46.99,7.49 JP16.3
A3
  Top 0.406: U2.A3 49.53,7.49 JP17.3
A4
  Top 0.406: U2.A4 52.07,7.49 JP18.3
A5
  Top 0.406: U2.A5 54.61,7.49 JP19.3
AIN1  (via drill 0.51)
  Top 0.203: 45.59,39.88 45.59,41.62 45.85,41.88 45.85,43.94
  Top 0.254: U2.D4 44.45,45.85 JP4.3 45.85,44.2 45.85,43.94 | U3.21 41.55,33.81 45.59,37.85 45.59,38.86 | 45.59,39.88 45.59,38.86 | v56.64,38.86 45.59,38.86
  Bottom 0.254: v56.64,38.86 TP1.P$1
AIN2  (via drill 0.51)
  Top 0.203: 43.05,39.88 43.05,41.62 43.31,41.88 43.31,43.94
  Top 0.254: U2.D5 41.91,45.85 JP5.3 43.31,44.2 43.31,43.94 | 43.05,39.88 v43.05,37.72 42.16,37.72 40.91,36.46 U3.22
  Bottom 0.254: 42.04,50.93 U2.D5 | v43.05,37.72 42.55,37.21 TP2.P$1
AOUT1
  Top 0.254: R2.2 56.39,18.8 56.9,19.3 56.9,20.32 | 56.9,20.32 56.9,22.1 56.13,22.86 JP21.4 | R1.2 56.9,20.32
  Top 0.381: U3.1 39.6,21.61 39.62,21.59 | U3.2 40.26,21.59 40.13,21.46
  Top 0.635: JP21.4 JP22.4 48.26,21.46 40.13,21.46 39.75,21.46 39.62,21.59
AOUT2  (via drill 0.51)
  Top 0.254: U3.6 42.85,24.71 | U3.5 42.2,24.43 v42.67,24.89 | D4.A v48.26,20.32 48.26,19.3 48.77,18.8 D5.C
  Top 0.381: 42.85,24.71 v42.67,24.89
  Top 0.635: JP21.3 JP22.3 | v42.67,24.89 v42.67,26.16
  Bottom 0.254: v48.26,20.32 47.75,20.83 47.75,24.89
  Bottom 0.635: JP22.3 48.26,25.4 47.75,24.89 v42.67,24.89 v42.67,26.16
BIN1  (via drill 0.51)
  Top 0.254: U2.D7 36.83,45.85 JP7.3 | U3.17 44.16,34.38 v45.85,36.07
  Bottom 0.254: JP7.3 36.7,45.59 34.67,43.56 34.67,35.94 35.18,35.43 44.45,35.43 45.09,36.07 v45.85,36.07 47.24,36.07 47.62,36.45 TP4.P$1
BIN2  (via drill 0.51)
  Top 0.254: U2.D8 33.02,45.85 JP8.3 | U3.16 44.8,33.76 v45.85,34.8
  Bottom 0.203: 31.62,39.88 31.62,41.66 31.88,41.91 31.88,43.94
  Bottom 0.254: JP8.3 31.88,44.7 31.88,43.94 | TP5.P$1 51.31,35.05 51.05,34.8 v45.85,34.8 34.8,34.8 33.78,35.81 33.78,36.58 31.62,38.73 31.62,39.88
BOUT1  (via drill 0.51)
  Top 0.254: R4.2 56.39,34.54 56.9,34.04 56.9,33.02 | 56.9,33.02 56.9,30.73 JP21.2 | R3.2 56.9,33.02
  Top 0.381: U3.12 46.76,24 | U3.11 46.1,23.88 46.23,24 46.76,24 | 46.76,24 46.76,24.62 46.74,24.64
  Top 0.635: JP21.2 JP22.2 | v46.74,27.43 v46.74,26.16 46.74,24.64
  Bottom 0.635: v46.74,26.16 v46.74,27.43 47.24,27.94 JP22.2
BOUT2
  Top 0.254: D7.C D6.A 50.18,32.14 49.91,31.88 JP22.1
  Top 0.381: U3.7 43.51,24.2 43.81,24.51 44.16,24.17 U3.8
  Top 0.635: JP21.1 JP22.1 48.51,30.48 47.75,29.72 47.75,29.21 47.24,28.7 46.23,28.7 44.96,27.43 44.45,27.43 43.81,26.8 43.81,24.51
D0/RXI  (via drill 0.51)
  Top 0.254: JP0.3 54.61,45.85 U2.RX | S2.1 19.97,28.54 18.03,30.48 v9.65,30.48
  Bottom 0.254: U2.RX 54.61,48.01 54.1,47.5 14.99,47.5 6.6,39.12 6.6,32.26 7.11,31.75 8.38,31.75 v9.65,30.48
D1/TXO  (via drill 0.51)
  Top 0.254: JP1.3 52.07,45.85 U2.TX | S2.4 14.32,28.61 13.46,29.46 9.14,29.46 v8.13,30.48
  Bottom 0.254: U2.TX 52.07,48.77 51.56,48.26 14.48,48.26 5.97,39.75 5.97,31.24 6.73,30.48 v8.13,30.48
D2
  Top 0.254: U2.D2 49.53,45.85 JP2.3
D9
  Top 0.254: U2.D9 30.48,45.85 JP9.3
D10
  Top 0.254: U2.D10 27.94,45.85 JP10.3
D11
  Top 0.254: U2.D11 25.4,45.85 JP11.3
D12
  Top 0.254: U2.D12 22.86,45.85 JP12.3
D13  (via drill 0.51)
  Top 0.254: U2.D13 20.32,45.85 JP13.3 18.8,45.72 17.53,46.99 13.72,46.99 v11.43,49.28 | v16.26,45.21 D8.A
  Bottom 0.254: TP7.P$1 10.54,48.39 v11.43,49.28 | v16.26,45.21 17.02,45.21 17.53,45.72 JP13.3
DIN  (via drill 0.51)
  Top 0.254: D2.C 11.43,13.21 11.94,12.7 U1.3 | Q1.2 21.69,26.48 R9.1 21.59,25.78 21.46,25.65 v21.46,25.15
  Bottom 0.254: U1.3 11.94,16.89 12.57,17.53 12.57,21.46 16.26,25.15 v21.46,25.15
DIO0
  Bottom 0.254: U1.20 7.97,33.68 10.03,31.62 19.18,31.62 JP24.3
DIO1
  Bottom 0.254: JP24.2 22.86,31.75 22.35,32.26 10.41,32.26 9.91,32.77 9.91,34 U1.19
DIO11
  Bottom 0.254: U1.7 22.86,14.6 JP23.2
DOUT  (via drill 0.51)
  Top 0.254: U1.2 9.94,9.05 9.14,8.26 D1.C | Q2.2 21.69,17.59 R12.1 20.23,17.69 v19.56,17.02
  Bottom 0.254: v19.56,17.02 16,17.02 15.49,17.53 13.72,17.53 13.21,18.03 13.21,20.57 15.75,23.11 21.59,23.11 22.61,24.13 22.61,25.65 22.23,26.04 15.62,26.04 11.94,22.35 11.94,18.03 9.94,16.04 U1.2
FUSED_3.3V  (via drill 0.51)
  Top 0.254: F3.2 24,9.39 24.26,9.65 27.43,9.65 27.94,10.16 27.94,12.95 27.18,13.72 18.54,13.72 17.87,14.39 R11.2 17.87,17.87 19.39,19.39 R12.2 21.69,19.49 23.11,19.49 | R7.1 5.84,11.56 | 5.84,11.56 7.82,11.56 U1.1 | R6.1 5.33,9.91 5.84,10.41 5.84,11.56 | R9.2 21.69,28.38 Q1.1 25.33,28.38 25.91,28.96 v26.67,28.96 | J2.2 v10.92,24.13 | Q2.1 23.11,19.49 | v23.11,20.45 23.11,19.49
  Bottom 0.254: U1.1 7.94,21.15 v10.92,24.13 13.46,26.67 24.13,26.67 | 24.13,26.67 24.38,26.67 v26.67,28.96 | v23.11,20.45 23.11,24.13 24.13,25.15 24.13,26.67
FUSED_5V  (via drill 0.51)
  Top 0.254: R10.2 C2.1 R13.2 26.04,21.21 26.42,20.83 27.69,20.83 28.32,20.19
  Top 0.381: U3.20 42.2,28.49 42.16,28.45 | U3.19 42.85,28.63 42.67,28.45
  Top 0.406: 32.09,8.3 F2.2
  Top 0.635: v39.37,28.45 42.16,28.45 42.67,28.45 | 32.09,8.3 34.97,8.3 35.56,8.89 35.56,12.19 36.58,13.21 36.58,14.73 36.07,15.24 34.29,15.24 33.02,16.51 31.75,16.51 30.48,17.78 28.7,17.78 27.94,18.54 27.94,19.81 28.32,20.19 v29.21,21.08
  Bottom 0.635: v29.21,21.08 32,21.08 v39.37,28.45
FUSED_IOREF  (via drill 0.51)
  Top 0.762: F4.2 v17.27,8.26 | S1.2 S1.5 36.32,26.67 36.83,26.16 v36.83,22.61 v36.83,21.34
  Bottom 0.762: JP19.2 JP18.2 JP17.2 JP16.2 JP15.2 JP14.2 38.61,10.16 | v17.27,8.26 33.15,8.26 35.05,10.16 38.61,10.16 | v36.83,22.61 v36.83,21.34 36.83,19.56 38.61,17.78 38.61,10.16
GND  (via drill 0.51)
  other vias: 1.14,6.73 3.81,15.37 1.27,15.37 58.42,6.35 13.34,9.91 11.68,4.83 19.05,49.28 13.97,49.28 33.53,7.11 34.92,49.28 55.63,48.26 10.92,26.67 45.21,26.16 26.67,25.15 34.04,17.78 36.83,16.26 36.83,17.78 41.15,26.16 41.15,24.89 44.2,28.7 48.01,31.75 16.89,43.94 1.52,50.55 11.68,36.07 9.14,45.72 43.43,1.02 58.42,12.7 58.42,20.32 58.42,33.02 58.42,36.83 40.89,16.26 41.78,19.56 37.85,28.7 36.58,27.94 35.05,21.34 29.97,22.61 16.76,27.69 6.6,16.26 4.06,18.8 2.79,39.12 1.02,39.12 9.91,28.45 3.68,29.97 9.91,40.39 8.38,39.12 6.6,23.62 1.78,36.83
  pour Top (isolate 0.305): 0,53.34 0,0 59.69,0 59.69,53.34
  pour Bottom (isolate 0.305): 0,0 59.69,0 59.69,53.34 0,53.34
IOREF
  Top 0.762: F4.1 21.72,2.67 U2.IOREF
N$1
  Top 0.254: D8.C 13.09,43.59 R5.2
N$2
  Top 0.254: R15.2 24.41,36.21 Q3.1 25.72,35.49 25.91,35.31 26.92,35.31 27.43,34.8 27.43,33.53 27.94,33.02 R14.2
N$3
  Top 0.254: R2.1 D5.A
N$4
  Top 0.254: R18.1 38.37,20.17 Q6.1 37.15,18.73 36.87,19.01 S3.6 33.31,19.01 33.02,19.3 31.75,19.3 31.46,19.01 S3.3
N$5
  Top 0.254: R1.1 D4.C
N$8
  Top 0.254: D7.A R4.1
N$9
  Top 0.254: D6.C R3.1
N$10  (via drill 0.51)
  Top 0.254: R17.2 18,45.25 17.02,46.23 11.43,46.23 8.89,43.69 | J1.VIN0 1.79,48.24 v1.78,48.26
  Top 0.813: 11.68,41.91 13,41.91 Q5.2
  Top 1.067: J1.VIN0 1.91,45.85 2.79,44.96 7.62,44.96 8.89,43.69 9.78,42.8 | 9.78,42.8 10.67,41.91 11.68,41.91 | J3.2 3.05,34.29 3.3,34.54 5.08,34.54 5.59,35.05 5.59,38.61 9.78,42.8
N$11
  Top 0.254: Q3.3 28.49,38.31 29.53,37.27 Q4.1 29.53,34.9 R16.1
N$12  (via drill 0.51)
  Top 0.254: S3.4 33.31,14.01 33.02,13.72 31.75,13.72 31.46,14.01 30.86,14.01 | S3.1 30.86,14.01 | v16.26,39.62 16.3,39.66 R17.1 16.28,41.89 Q5.1 | v30.86,12.45 30.86,14.01
  Bottom 0.254: v16.26,39.62 16.26,36.83 17.27,35.81 29.97,35.81 30.99,34.8 30.99,25.4 28.07,22.48 28.07,19.94 30.86,17.14 v30.86,12.45
N$13
  Top 0.762: R14.1 31.33,31.84 30.73,31.24 29.21,31.24 27.94,29.97 27.94,24.89 28.66,24.17 S1.1 31.07,24.17 31.5,23.75 33.27,23.75 33.7,24.17 S1.4
N$14  (via drill 0.51)
  other vias: 8.13,36.83
N$15
  Top 0.813: Q5.3 13.97,38.86
  Top 1.067: 13.97,38.86 D9.A
N$16
  Top 0.813: Q6.3 D10.A
N$22
  Top 0.254: R6.2 2.55,9.88 D1.A
N$43
  Top 0.254: D2.A 2.55,11.58 R7.2
N$44
  Top 0.254: D3.A 3.95,31.4 R8.1
PWMA  (via drill 0.51)
  Top 0.254: U2.D3 46.99,45.85 JP3.3 | U3.23 40.26,36.2 v39.24,37.21
  Bottom 0.203: 48.13,39.88 48.13,41.78 48.39,42.04 48.39,43.81
  Bottom 0.254: JP3.3 47.12,45.72 48.39,44.45 48.39,43.81 | 48.13,39.88 48.13,39.24 47.5,38.61 39.24,38.61 38.54,37.91 | 38.54,37.91 37.59,36.96 TP3.P$1 | v39.24,37.21 38.54,37.91
PWMB  (via drill 0.51)
  Top 0.203: 37.97,39.88 37.97,41.66 38.23,41.91 38.23,43.69
  Top 0.254: U2.D6 39.37,45.85 JP6.3 38.23,44.7 38.23,43.69 | v38.1,33.78 38.1,34.8 37.97,34.92 37.97,39.88 | U3.15 45.45,32.37 45.85,32.77 v45.85,33.53
  Bottom 0.254: v38.1,33.78 41.4,33.78 41.66,33.53 v45.85,33.53 53.34,33.53 53.85,34.04 TP6.P$1
PWR_RAIL
  Top 0.762: 34.92,43.05 35.05,43.18
  Top 0.813: Q4.3 31.45,38.31
  Top 1.067: JP7.2 35.05,43.18 JP8.2 JP9.2 JP10.2 JP11.2 JP12.2 JP13.2 | JP3.2 JP2.2 | 34.23,39.18 33.36,38.31 31.45,38.31 | 34.23,39.18 34.92,39.88 34.92,43.05 | 34.23,39.18 35.81,37.59 35.81,35.81 35.21,35.21 S1.6 33.57,29.17 33.27,29.46 31.5,29.46 31.2,29.17 S1.3
  Bottom 1.067: JP3.2 JP4.2 JP5.2 JP6.2 JP7.2 | JP2.2 JP1.2 JP0.2
RESET  (via drill 0.51)
  Top 0.254: v12.19,2.16 S4.4 S4.3
  Bottom 0.254: TP12.P$1 12.45,1.27 12.19,1.52 v12.19,2.16 12.19,3.56 12.7,4.06 22.35,4.06 U2.RES
RSSI
  Top 0.254: U1.6 17.94,13.18 17.27,13.84 7.24,13.84 2.79,18.29 2.79,25.65 5.68,28.54 R8.2
  Bottom 0.254: U1.6 20.32,14.42 JP23.3
SCL  (via drill 0.51)
  Top 0.254: v6.35,19.05 v10.92,19.05 J2.4
  Bottom 0.254: U2.SCL 7.24,50.8 4.19,47.75 4.19,39.88 4.7,39.37 4.7,20.7 5.33,20.07 5.59,19.81 v6.35,19.05
SDA  (via drill 0.51)
  Top 0.254: J2.3 v10.92,21.59 v6.86,21.59
  Bottom 0.254: U2.SDA 12.7,49.02 10.92,47.24 8.13,47.24 4.83,43.94 4.83,40.26 5.33,39.75 5.33,23.11 v6.86,21.59
VIN
  Top 0.254: R18.2 40.22,19.39 39.5,18.67 39.5,15.62 39.37,15.49 38.35,15.49
  Top 0.813: Q6.2 38.37,15.76 38.35,15.75
  Top 1.067: 38.35,15.75 38.35,15.49 38.35,13.21 36.83,11.68 U2.VIN
  Bottom 0.254: TP10.P$1 37.47,3.17 U2.VIN
VMOTOR  (via drill 0.51)
  Top 0.254: R16.2 32.77,34.8 | 46.76,32.11 46.63,32.11 v46.61,32.13
  Top 0.381: U3.14 46.1,31.63 v46.61,32.13 46.76,31.98 U3.13 | U3.24 37.49,30.33 v37.47,30.35 | C1.1 48.39,36.7 48.51,36.83
  Top 0.813: Q4.2 31.45,36.2 32.26,36.2 | C3.1 48.51,36.83 47.62,36.83 47.12,36.32 47.12,32.64 v46.61,32.13
  Top 1.067: v20.32,38.1 20.32,37.59 | 20.32,37.59 v20.32,36.83 | D9.C 20.19,37.47 20.32,37.59 | v45.21,20.07 v46.48,20.07 46.6,19.95 D10.C 47.75,17.78 49.02,16.51 C4.1 | 32.26,36.2 32.38,36.2 32.77,35.81 32.77,34.8 v32.77,33.53 v32.77,32
  Bottom 0.381: v37.47,30.35 37.47,32.13 37.34,32.26
  Bottom 1.067: v20.32,38.1 v20.32,36.83 32,36.83 32.77,36.07 v32.77,33.53 v32.77,32 35.81,32 36.07,32.26 37.34,32.26 38.35,32.26 39.75,30.86 | v46.48,20.07 v45.21,20.07 43.43,20.07 39.12,24.38 39.12,26.16 40.89,27.94 40.89,29.72 39.75,30.86 | v46.61,32.13 41.02,32.13 39.75,30.86
XBEE_RESET  (via drill 0.51)
  Top 0.254: R11.1 v14.73,16.51 | U1.5 15.94,10.48 14.48,9.02 14.48,7.68 SJ5.1
  Bottom 0.254: U1.5 15.94,15.3 v14.73,16.51
XBEE_RXI  (via drill 0.51)
  Top 0.254: v27.43,23.62 26.12,23.62 R13.1 | v26.54,19.81 26.54,18.59 Q2.3 | S2.2 19.05,22.86 18.92,22.73 v18.92,21.59
  Bottom 0.254: v27.43,23.62 27.43,20.7 v26.54,19.81 26.04,19.3 22.35,19.3 20.07,21.59 v18.92,21.59
XBEE_TXO
  Top 0.254: S2.5 17.53,22.86 18.8,24.13 20.57,24.13 20.99,23.71 R10.1 22.23,24.49 22.45,24.71 23.44,24.71 24.13,25.4 25.4,25.4 26.5,26.5 Q1.3

### Text on the board
Bottom: v14
tPlace: Max / VS: 15V | SCL | SDA | AREF | GND | 13 | 12 | ~11 | ~10 | ~9 | 8 | 7 | ~6 | ~5 | 4 | ~3 | 2 | TX | RX | D13 | SIG | PWR | GND | DIR_B1 | DIR_B0 | PWM_B | DIR_A1 | DIR_A0 | PWM_A | RSSI | + | - | IOREF | VS | GND | - | XBee Serial / Select | DIO0 | DIO1 | B | I2C Port | + | GND | HW_SER | Power Rail | MOTORS | - | 3.3V | A | VMOTOR | + | SDA | VIN | SCL | SW_SER | Motor Power | RSSI | DIO11 | GND | SW_SER | Analog In | TX | VS | GND | XBEE | PWR | XBEE RESET | RX | SIG | RESET | IOREF | RST | 3.3V | 5V | GND | GND | VIN | Max / VIN: 15V | A0 | A1 | A2 | A3 | A4 | A5
bPlace: SCL | SDA | AREF | GND | 13 | 12 | ~11 | ~10 | ~9 | 8 | 7 | ~6 | ~5 | 4 | ~3 | 2 | TX | RX | SIG | PWR | GND | - | DIO0 | DIO1 | GND | B | I2C Port | + | GND | - | 3.3V | A | Wireless Motor / Driver Shield | + | SDA | SCL | GND | RSSI | DIO11 | GND | PWR | SIG | IOREF | RST | 3.3V | 5V | GND | GND | VIN | A0 | A1 | A2 | A3 | A4 | A5
tValues: L298P013TR
Measures: All measurements are in inches.
tDocu: B. Huang | Revised by: Shawn Hymel